# Altium project Earphone.PrjPCB
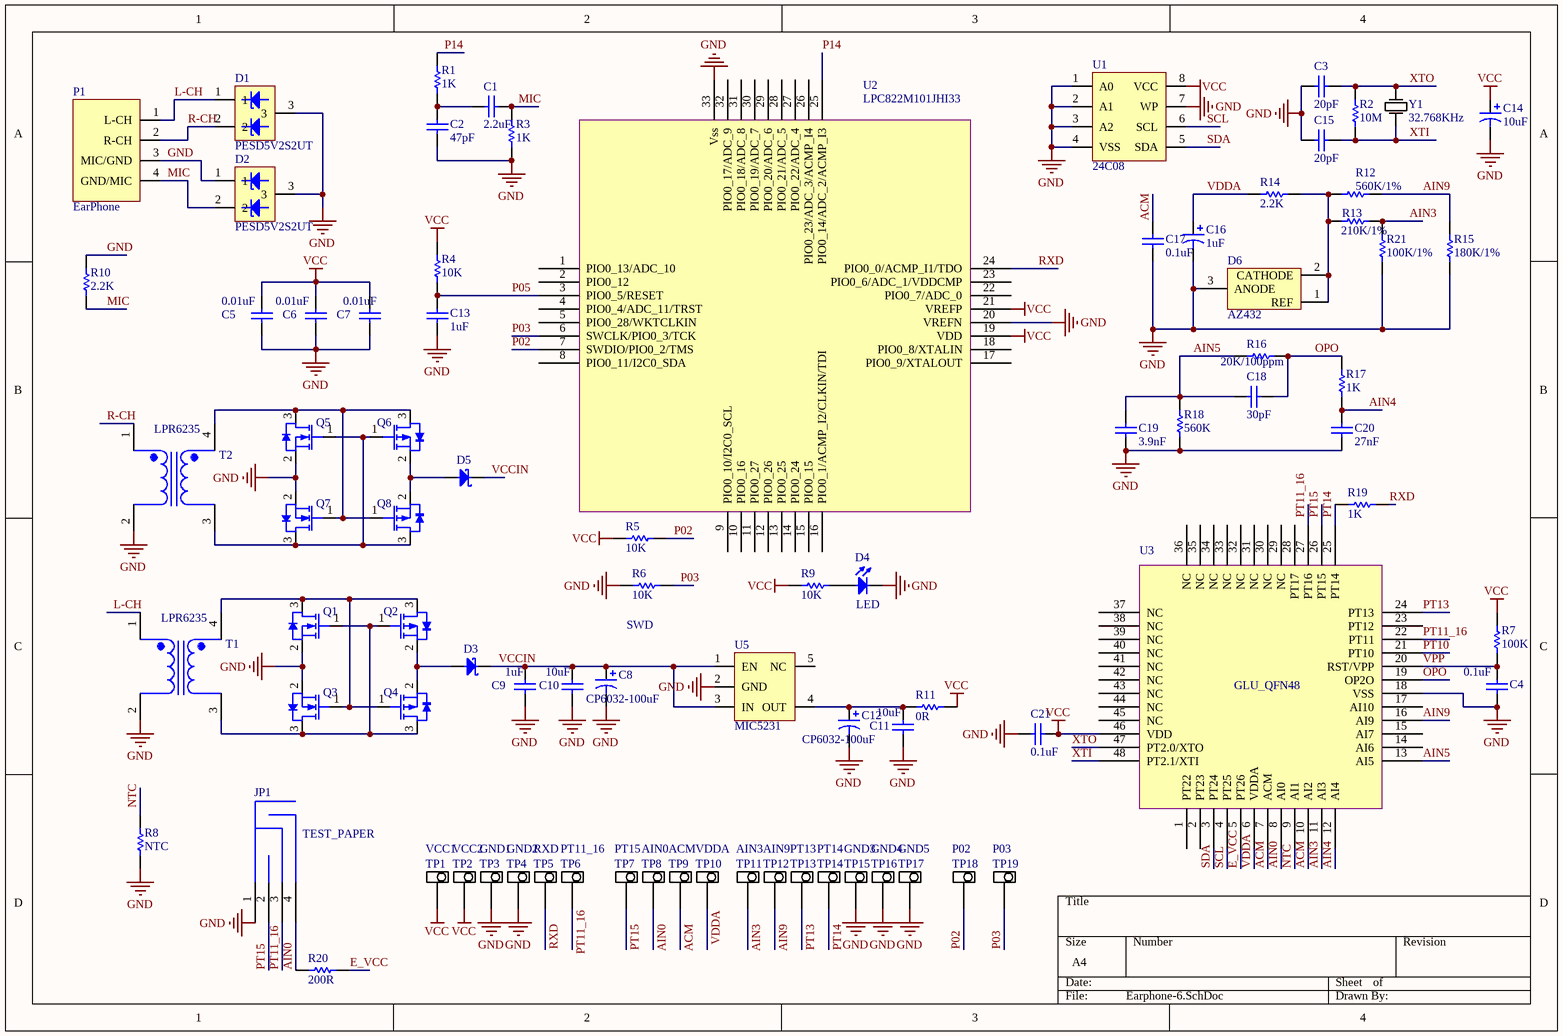
[diagram p0: Earphone-6.SchDoc]
1 sheet, 84 parts. Net scope: global (net labels, ports and power ports of the same name join across sheets).
Board file: Earphone-6.PcbDoc

## Sheet Earphone-6.SchDoc
size A4

### Parts
ACM  TP9  [SIP1]
AIN0  TP8  [SIP1]
AIN3  TP11  [SIP1]
AIN9  TP12  [SIP1]
C1  2.2uF  [0402C]
C2  47pF  [0402C]
C3  20pF  [0402C]
C4  0.1uF  [0402C]
C5  0.01uF  [0402C]
C6  0.01uF  [0402C]
C7  0.01uF  [0402C]
C8  CP6032-100uF  [T3216-18[A]]
C9  1uF  [0402C]
C10  10uF  [0402C]
C11  10uF  [0402C]
C12  CP6032-100uF  [T3216-18[A]]
C13  1uF  [0402C]
C14  10uF  [0402C]
C15  20pF  [0402C]
C16  1uF  [0402C]
C17  0.1uF  [0402C]
C18  30pF  [0402C]
C19  3.9nF  [0402C]
C20  27nF  [0402C]
C21  0.1uF  [0402C]
D1  PESD5V2S2UT  [SOT23]
D2  PESD5V2S2UT  [SOT23]
D3  PMEG4002EJ  [SOD323]  (value not drawn)
D4  LED  [0603L]
D5  PMEG4002EJ  [SOD323]  (value not drawn)
D6  AZ432  [SOT23]
GND1  TP3  [SIP1]
GND2  TP4  [SIP1]
GND3  TP15  [SIP1]
GND4  TP16  [SIP1]
GND5  TP17  [SIP1]
JP1  TEST_PAPER  [TEST_PAPER]
P1  EarPhone  [USB-A]
P02  TP18  [SIP1]
P03  TP19  [SIP1]
PT11_16  TP6  [SIP1]
PT13  TP13  [SIP1]
PT14  TP14  [SIP1]
PT15  TP7  [SIP1]
Q1  N-MOSFET  [SOT23]  (value not drawn)
Q2  P-MOSFET  [SOT23]  (value not drawn)
Q3  N-MOSFET  [SOT23]  (value not drawn)
Q4  P-MOSFET  [SOT23]  (value not drawn)
Q5  N-MOSFET  [SOT23]  (value not drawn)
Q6  P-MOSFET  [SOT23]  (value not drawn)
Q7  N-MOSFET  [SOT23]  (value not drawn)
Q8  P-MOSFET  [SOT23]  (value not drawn)
R1  1K  [0402R]
R2  10M  [0402R]
R3  1K  [0402R]
R4  10K  [0402R]
R5  10K  [0402R]
R6  10K  [0402R]
R7  100K  [0402R]
R8  NTC  [0603R]
R9  10K  [0402R]
R10  2.2K  [0402R]
R11  0R  [0402R]
R12  560K/1%  [0402R]
R13  210K/1%  [0402R]
R14  2.2K  [0402R]
R15  180K/1%  [0402R]
R16  20K/100ppm  [0402R]
R17  1K  [0402R]
R18  560K  [0402R]
R19  1K  [0402R]
R20  200R  [0402R]
R21  100K/1%  [0402R]
RXD  TP5  [SIP1]
T1  LPR6235  [Trans EMI]
T2  LPR6235  [Trans EMI]
U1  24C08  [SOP-8]
U2  LPC822M101JHI33  [QFN50P500X500X100-33N]
U3  GLU_QFN48  [QFN_48PIN]
U5  MIC5231  [SOT23-5]
VCC1  TP1  [SIP1]
VCC2  TP2  [SIP1]
VDDA  TP10  [SIP1]
Y1  32.768KHz  [Y1]

### Nets
GND: C2.1 C3.1 C4.1 C5.1 C6.1 C7.1 C8.2 C9.1 C10.1 C11.1 C12.2 C13.1 C14.2 C15.1 C16.2 C17.1 C19.1 C20.2 C21.1 D1.3 D2.1 D2.3 D4.2(K) D6.3(ANODE) GND1.1 GND2.1 GND3.1 GND4.1 GND5.1 JP1.1(N) P1.3(MIC/GND) Q1.2(S) Q3.2(S) Q5.2(S) Q7.2(S) R3.2 R6.2 R8.1 R10.2 R15.2 R18.2 R21.1 T1.2 T2.2 U1.1(A0) U1.2(A1) U1.3(A2) U1.4(VSS) U1.7(WP) U2.20(VREFN) U2.33(Vss) U3.18(VSS) U5.2(GND)
VCC: C5.2 C6.2 C7.2 C14.1 C21.2 R4.2 R5.1 R7.2 R9.1 R11.2 U1.8(VCC) U2.19(VDD) U2.21(VREFP) U3.46(VDD) VCC1.1 VCC2.1
ACM: ACM.1 C17.2 U3.7(ACM) U3.10(AI2)
AIN0: AIN0.1 JP1.4(P) R20.1 U3.8(AI0)
AIN3: AIN3.1 R13.1 R21.2 U3.11(AI3)
AIN4: C20.1 R17.1 U3.12(AI4)
AIN5: C18.2 C19.2 R16.2 R18.1 U3.13(AI5)
AIN9: AIN9.1 R12.1 R15.1 U3.16(AI9)
E_VCC: R20.2 U3.5(PT26)
L-CH: D1.1 P1.1(L-CH) T1.1
MIC: C1.1 D2.2 P1.4(GND/MIC) R3.1 R10.1
NTC: R8.2 U3.9(AI1)
OPO: C18.1 R16.1 R17.2 U3.19(OP2O)
P02: P02.1 R5.2 U2.7(SWDIO/PIO0_2/TMS)
P03: P03.1 R6.1 U2.6(SWCLK/PIO0_3/TCK)
P05: C13.2 R4.1 U2.3(PIO0_5/RESET)
P14: R1.1 U2.25(PIO0_14/ADC_2/ACMP_I3)
PT10: U3.21(PT10)
PT11_16: JP1.3(NOP) PT11_16.1 U3.22(PT11) U3.27(PT16)
PT13: PT13.1 U3.24(PT13)
PT14: PT14.1 R19.2 U3.25(PT14)
PT15: JP1.2(PC10) PT15.1 U3.26(PT15)
R-CH: D1.2 P1.2(R-CH) T2.1
RXD: R19.1 RXD.1 U2.24(PIO0_0/ACMP_I1/TDO)
SCL: U1.6(SCL) U3.4(PT25)
SDA: U1.5(SDA) U3.3(PT24)
VCCIN: C8.1 C9.2 C10.2 D3.1 D5.1 U5.1(EN) U5.3(IN)
VDDA: C16.1 R14.1 U3.6(VDDA) VDDA.1
VPP: C4.2 R7.1 U3.20(RST/VPP)
XTI: C15.2 R2.1 U3.48(PT2.1/XTI) Y1.1
XTO: C3.2 R2.2 U3.47(PT2.0/XTO) Y1.2
NetC1_2: C1.2 C2.2 R1.2
NetC11_2: C11.2 C12.1 R11.1 U5.4(OUT)
NetD3_2: D3.2 Q2.2(S) Q4.2(S)
NetD4_1: D4.1(A) R9.2
NetD5_2: D5.2 Q6.2(S) Q8.2(S)
NetD6_1: D6.1(REF) D6.2(CATHODE) R12.2 R13.2 R14.2
NetQ1_1: Q1.1(G) Q2.1(G) Q3.3(D) Q4.3(D) T1.3
NetQ1_3: Q1.3(D) Q2.3(D) Q3.1(G) Q4.1(G) T1.4
NetQ5_1: Q5.1(G) Q6.1(G) Q7.3(D) Q8.3(D) T2.3
NetQ5_3: Q5.3(D) Q6.3(D) Q7.1(G) Q8.1(G) T2.4

Not connected (* = marked no-connect by the designer): U2 1(PIO0_13/ADC_10) 2(PIO0_12) 4(PIO0_4/ADC_11/TRST) 5(PIO0_28/WKTCLKIN) 8(PIO0_11/I2C0_SDA) 9(PIO0_10/I2C0_SCL) 10(PIO0_16) 11(PIO0_27) 12(PIO0_26) 13(PIO0_25) 14(PIO0_24) 15(PIO0_15) 16(PIO0_1/ACMP_I2/CLKIN/TDI) 17(PIO0_9/XTALOUT) 18(PIO0_8/XTALIN) 22(PIO0_7/ADC_0) 23(PIO0_6/ADC_1/VDDCMP) 26(PIO0_23/ADC_3/ACMP_I4) 27(PIO0_22/ADC_4) 28(PIO0_21/ADC_5) 29(PIO0_20/ADC_6) 30(PIO0_19/ADC_7) 31(PIO0_18/ADC_8) 32(PIO0_17/ADC_9); U3 1(PT22) 2(PT23) 14(AI6) 15(AI7) 17(AI10) 23(PT12) 28(PT17) 29(NC) 30(NC) 31(NC) 32(NC) 33(NC) 34(NC) 35(NC) 36(NC) 37(NC) 38(NC) 39(NC) 40(NC) 41(NC) 42(NC) 43(NC) 44(NC) 45(NC); U5 5(NC)

### Notes on the sheet
- SWD

### Library data of the parts
ACM AIN0 AIN3 AIN9 GND1-GND5 P02 P03 PT11_16 PT13-PT15 RXD VCC1 VCC2 VDDA = TEST_PAD
C1-C7 C9-C11 C13 C15 C17-C21 = CAP
C8 C12 C14 C16 = CAP POL2
D1 D2 = PESD5V2S2UT: SOT23
D3 D5 = PMEG4002EJ: SOD323F
Q1 Q3 Q5 Q7 = N-MOSFET: 4N80 N-Channel MOSFET
Q2 Q4 Q6 Q8 = P-MOSFET: P-Channel MOSFET
R1-R21 = RES
T1 T2 = Trans EMI